# EAGLE design USB_Power_Adapter_V2 (EAGLE 6.5.0)
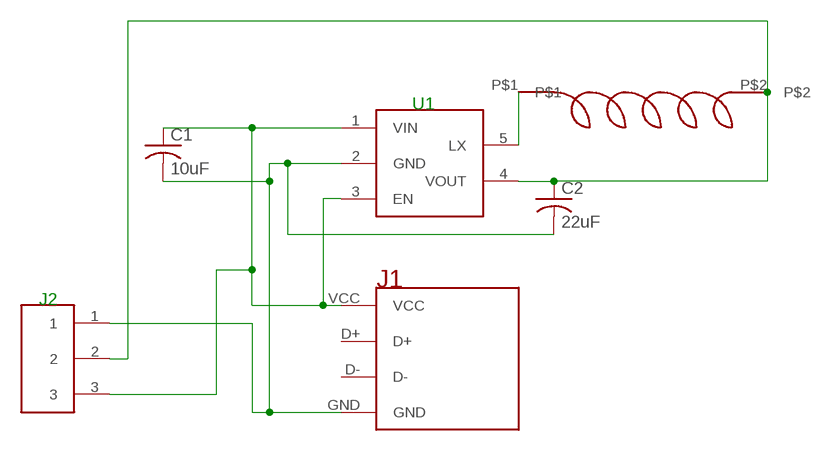
[diagram p0: schematic, sheet 1]

## Parts
C1  10uF  C-USC0805K  [C0805K]
C2  22uF  C-USC0805K  [C0805K]
J1  MICROUSBMICROUSB_THRU  [MICROUSB_THRU]
U1  SC189  [SC189]
U$1  SMDINDUCTOR  [SMDINDUCTOR]
U$2  DF3_1X3  [DF3_1X3]

## Nets
GND: C1.2 C2.2 J1.GND U1.2(GND) U$2.1
L: U1.5(LX) U$1.P$1
VIN: C1.1 J1.VCC U1.1(VIN) U1.3(EN) U$2.3
VOUT: C2.1 U1.4(VOUT) U$1.P$2 U$2.2
Unconnected: J1.D+ J1.D-

## Notes on the sheet
- U1
- J2

## Library data of the parts
C1 C2 = resistor:C-US: CAPACITOR, American symbol
J1 = ScottSilver:MICROUSB
U1 = ScottSilver:SC189
U$1 = ScottSilver:SMDINDUCTOR
U$2 = ScottSilver:DF3_1X3

## Board
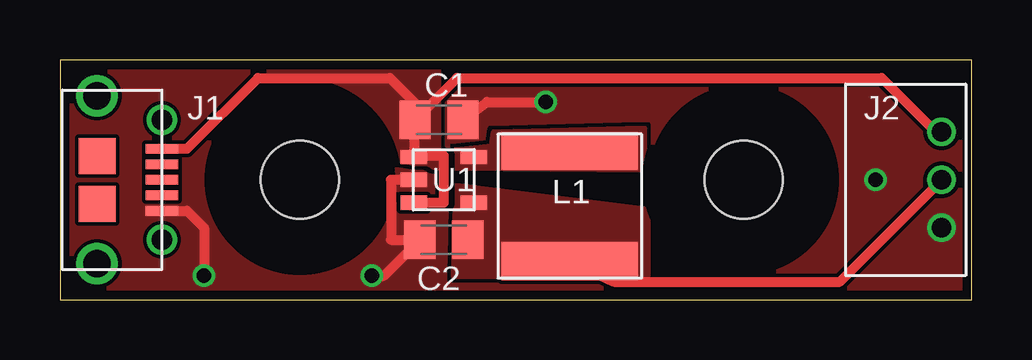
[diagram p1: board, top side]
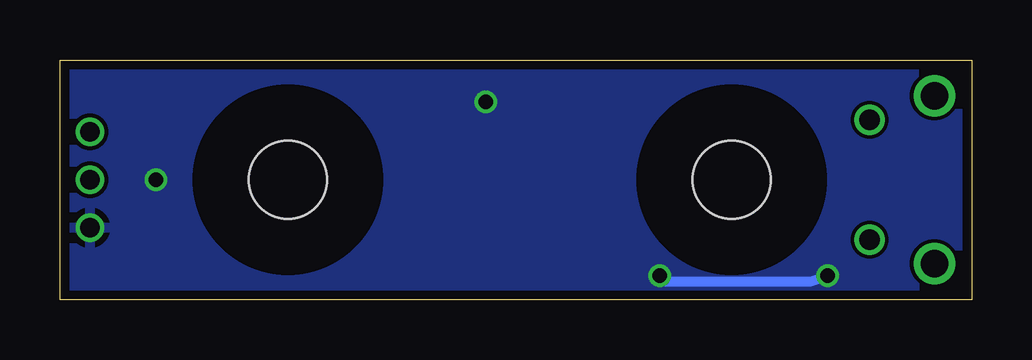
[diagram p2: board, bottom side, seen from below]

Size 38 x 10 mm. Coordinates in mm from the lower left corner, seen from the top.
Outline: 0,0 38,0 38,10 0,10 0,0
Copper layers (1*16): Top 0.0356mm / dielectric 1.5011mm / Bottom 0.0356mm
Design rules "LaenPCBOrder *": minimum track width 6mil, minimum drill 13mil, track to track 6mil, track to pad 6mil, pad to pad 6mil, via to via 6mil, smd to smd 6mil, copper to edge 15mil, drill to drill 6mil, minimum pad ring 7mil, minimum via ring 7mil, stop-mask expansion 3mil, vias tented up to drill 0mil, thermal gap 10mil
Holes 3.26 mm at 10,5 28.5,5
tRestrict: area 6.2,1.2 to 13.8,8.8; area 24.7,1.2 to 32.3,8.8
bRestrict: area 24.7,1.2 to 32.3,8.8; area 6.2,1.2 to 13.8,8.8

### Footprints (pad centres in the part's own frame; a part is rotated, then mirrored left to right if it is on the bottom)
C0805K = smd 1.3 x 1.6: 1 -1,0; 2 1,0
MICROUSB_THRU = smd 1.35 x 0.4: D+ 0,0; D- 0,0.65; GND 0,-1.3; ID 0,-0.65; VCC 0,1.3 | drill 1.15: P$1 -2.7,3.5; P$2 -2.7,-3.5 | drill 0.85: P$3 0,2.5; P$4 0,-2.5 | smd 1.55 x 1.5: P$6 -2.7,1; P$7 -2.7,-1
SC189 = smd 0.6 x 1.1: 1 -0.95,-1.25; 2 0,-1.25; 3 0.95,-1.25; 4 0.95,1.25; 5 -0.95,1.25
SMDINDUCTOR = smd 1.6 x 5.7: P$1 -2.3,0; P$2 2.3,0
DF3_1X3 = drill 0.8: 1 -2,-1.5; 2 0,-1.5; 3 2,-1.5

### Placement (x,y rotation side)
C1  15.8,7.5 0 top
C2  16,2.5 180 top
J1  4.25,5 0 top
U1  16,5 270 top
U$1  21.25,3.9 270 top
U$2  35.25,5 90 top

### Tracks (layer width: path | path; a pad name or v marks a point on that pad's centre or on a via)
GND  (via drill 0.6)
  Top 0.406: J1.GND 5.3,3.7 6,3 v6,1 | v13,1 13.5,1 C2.2 13.8,2.5 13.8,5 U1.2 | C1.2 17.8,8.25 v20.25,8.25
  Bottom 0.406: v6,1 6.75,0.75 12.75,0.75 v13,1
  other vias: 34,5
  pour Bottom (rank 6): 0.3,10 38,10 38,0 0.3,0
  pour Top (rank 6, no thermals): 0.3,9.8 0.3,-0.2 38,0 38,10
L
  pour Top (isolate 0.254, no thermals): 16.5,6.25 18,6.4 18.1,7 24.35,7.15 24.35,5.4 16.5,5.5
VIN
  Top 0.406: J1.VCC 5.3,6.3 8.25,9.25 13.75,9.25 14.8,8.2 C1.1 | C1.1 14.75,7.45 U1.1 14.75,6 16,6 16,4.05 U1.3 | C1.1 16.55,9.25 34.25,9.25 36.5,7 U$2.3
  pour Top (isolate 0.254, no thermals): 15.75,9.75 15.75,5.5 13.65,5.9 13.4,7.7 11.85,8.75 8.85,9.25 8.55,9.8
VOUT
  Top 0.406: U$1.P$2 23.1,0.75 32.5,0.75 U$2.2
  pour Top (isolate 0.254, no thermals): 24.5,3.75 16.5,4.75 16.4,1 24.5,1

### Text on the board
tPlace: J1 | J2 | U1 | L1